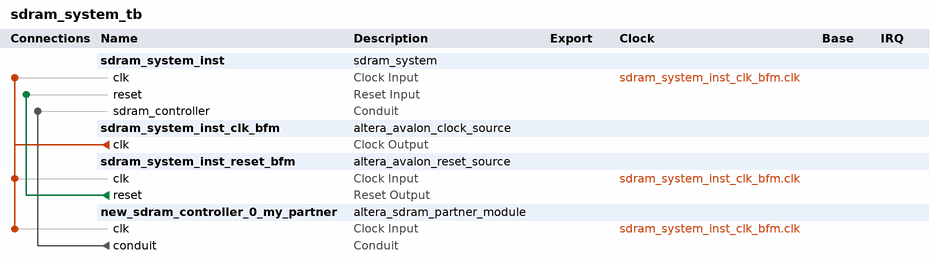
[diagram p0: system contents]
# Platform Designer (Qsys) system sdram_system_tb, Cyclone II EP2C20F484C7
# Parameters at their usual value, and those the tool derives, are not listed.
package require -exact qsys 13.0
create_system sdram_system_tb
set_project_property DEVICE_FAMILY {Cyclone II}
set_project_property DEVICE EP2C20F484C7

add_instance sdram_system_inst sdram_system 1.0

add_instance sdram_system_inst_clk_bfm altera_avalon_clock_source 13.0

add_instance sdram_system_inst_reset_bfm altera_avalon_reset_source 13.0
set_instance_parameter_value sdram_system_inst_reset_bfm ASSERT_HIGH_RESET 0
set_instance_parameter_value sdram_system_inst_reset_bfm INITIAL_RESET_CYCLES 50

add_instance new_sdram_controller_0_my_partner altera_sdram_partner_module 11.0
set_instance_parameter_value new_sdram_controller_0_my_partner SDRAM_DATA_WIDTH 16
set_instance_parameter_value new_sdram_controller_0_my_partner SDRAM_COL_WIDTH 8
set_instance_parameter_value new_sdram_controller_0_my_partner SDRAM_ROW_WIDTH 12
set_instance_parameter_value new_sdram_controller_0_my_partner CONTR_NAME sdram_system_new_sdram_controller_0

# connections
add_connection sdram_system_inst_clk_bfm.clk new_sdram_controller_0_my_partner.clk clock
add_connection sdram_system_inst_clk_bfm.clk sdram_system_inst.clk clock
add_connection sdram_system_inst_clk_bfm.clk sdram_system_inst_reset_bfm.clk clock
add_connection sdram_system_inst_reset_bfm.reset sdram_system_inst.reset reset
add_connection new_sdram_controller_0_my_partner.conduit sdram_system_inst.sdram_controller conduit

set_interconnect_requirement {$system} qsys_mm.clockCrossingAdapter HANDSHAKE
set_interconnect_requirement {$system} qsys_mm.maxAdditionalLatency 1

save_system sdram_system_tb.qsys
